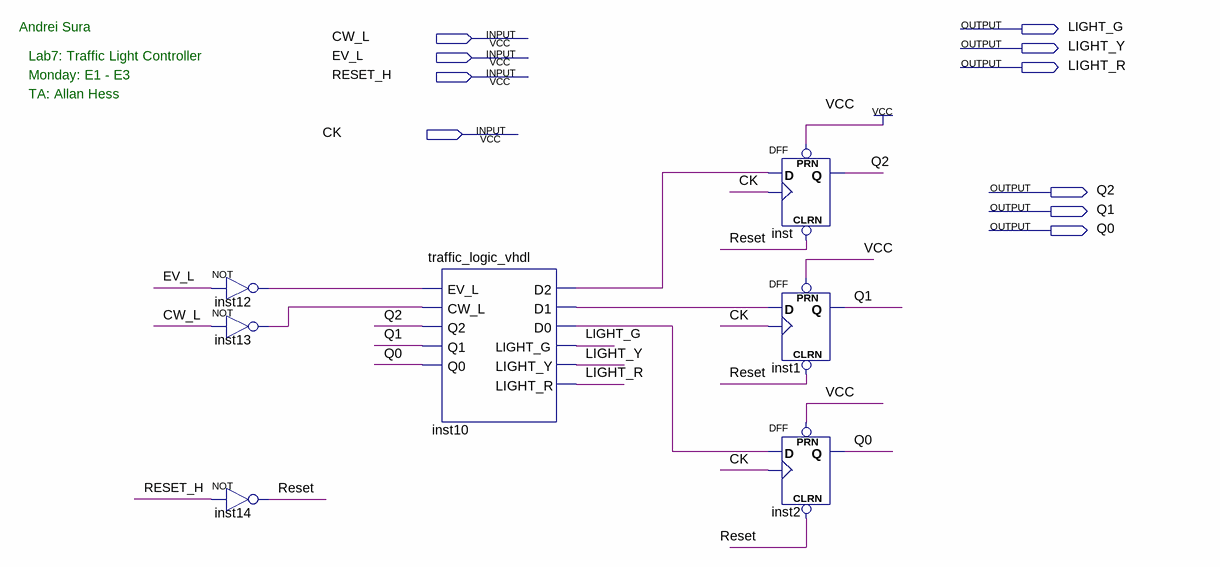
[diagram p0: schematic sheet]
// Quartus schematic lab_7_traffic_controller.bdf as structural Verilog: 7 symbols, 10 pins
module lab_7_traffic_controller (
  input  CW_L,
  input  EV_L,
  input  RESET_H,
  input  CK,
  output LIGHT_G,
  output LIGHT_Y,
  output LIGHT_R,
  output Q2,
  output Q1,
  output Q0
);

  wire inst10_d0, inst10_d1, inst10_d2, inst12_out, inst13_out, Reset;

  not inst12 (inst12_out, EV_L);
  not inst13 (inst13_out, CW_L);
  not inst14 (Reset, RESET_H);
  traffic_logic_vhdl inst10 (
    .EV_L(inst12_out), .CW_L(inst13_out), .Q2(Q2), .Q1(Q1), .Q0(Q0), .D2(inst10_d2), .D1(inst10_d1),
    .D0(inst10_d0), .LIGHT_G(LIGHT_G), .LIGHT_Y(LIGHT_Y), .LIGHT_R(LIGHT_R));
  DFF inst (.CLRN(Reset), .CLK(CK), .D(inst10_d2), .PRN(1'b1), .Q(Q2));
  DFF inst1 (.CLRN(Reset), .CLK(CK), .D(inst10_d1), .PRN(1'b1), .Q(Q1));
  DFF inst2 (.CLRN(Reset), .CLK(CK), .D(inst10_d0), .PRN(1'b1), .Q(Q0));

  // Notes on the sheet:
  //   Andrei Sura
  //   Lab7: Traffic Light Controller
  //   Monday: E1 - E3
  //   TA: Allan Hess
endmodule
